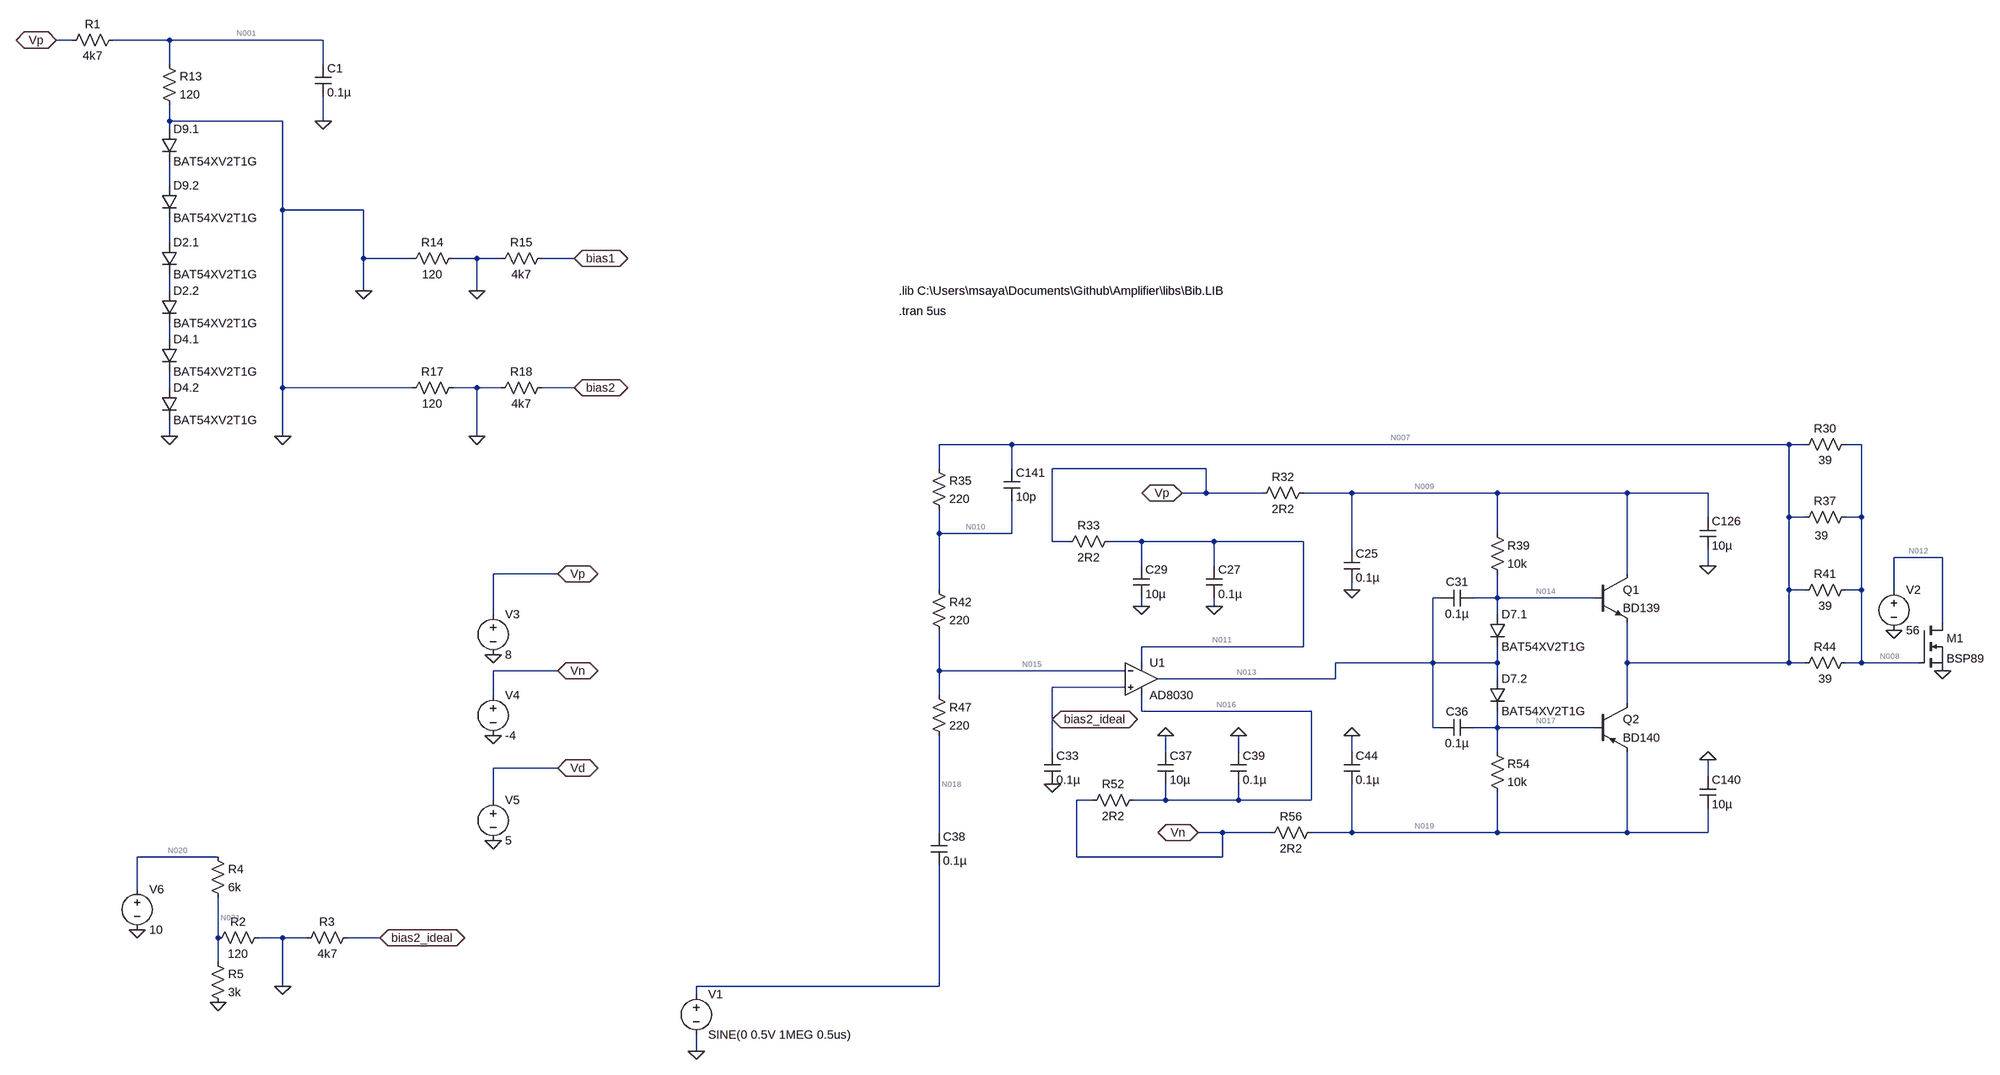
[diagram p0: schematic inv.asc]
inv.asc, the LTspice schematic file:
Version 4
SHEET 1 4920 3700
WIRE -480 1680 -512 1680
WIRE -288 1680 -400 1680
WIRE 16 1680 -288 1680
WIRE -288 1728 -288 1680
WIRE 16 1728 16 1680
WIRE -288 1840 -288 1808
WIRE -64 1840 -288 1840
WIRE 16 1840 16 1792
WIRE -288 1856 -288 1840
WIRE -288 1968 -288 1920
WIRE -64 2016 -64 1840
WIRE 96 2016 -64 2016
WIRE -288 2080 -288 2032
WIRE 96 2112 96 2016
WIRE 192 2112 96 2112
WIRE 320 2112 272 2112
WIRE 368 2112 320 2112
WIRE 512 2112 448 2112
WIRE -288 2176 -288 2144
WIRE 96 2176 96 2112
WIRE 320 2176 320 2112
WIRE -288 2272 -288 2240
WIRE -288 2368 -288 2336
WIRE -64 2368 -64 2016
WIRE 192 2368 -64 2368
WIRE 320 2368 272 2368
WIRE 368 2368 320 2368
WIRE 512 2368 448 2368
WIRE -288 2464 -288 2432
WIRE -64 2464 -64 2368
WIRE 320 2464 320 2368
WIRE 1536 2480 1392 2480
WIRE 3072 2480 1536 2480
WIRE 3104 2480 3072 2480
WIRE 3216 2480 3184 2480
WIRE 1392 2528 1392 2480
WIRE 1536 2528 1536 2480
WIRE 1920 2528 1616 2528
WIRE 1920 2576 1920 2528
WIRE 1920 2576 1872 2576
WIRE 2032 2576 1920 2576
WIRE 2208 2576 2112 2576
WIRE 2496 2576 2208 2576
WIRE 2752 2576 2496 2576
WIRE 2912 2576 2752 2576
WIRE 2912 2624 2912 2576
WIRE 3072 2624 3072 2480
WIRE 3104 2624 3072 2624
WIRE 3216 2624 3216 2480
WIRE 3216 2624 3184 2624
WIRE 1392 2656 1392 2608
WIRE 1536 2656 1536 2592
WIRE 1536 2656 1392 2656
WIRE 2496 2656 2496 2576
WIRE 1616 2672 1616 2528
WIRE 1648 2672 1616 2672
WIRE 1792 2672 1728 2672
WIRE 1936 2672 1792 2672
WIRE 2112 2672 1936 2672
WIRE 2208 2688 2208 2576
WIRE 3376 2704 3280 2704
WIRE 1792 2720 1792 2672
WIRE 1936 2720 1936 2672
WIRE 2912 2720 2912 2688
WIRE 480 2736 352 2736
WIRE 2752 2736 2752 2576
WIRE 1392 2768 1392 2656
WIRE 2208 2768 2208 2752
WIRE 3072 2768 3072 2624
WIRE 3104 2768 3072 2768
WIRE 3216 2768 3216 2624
WIRE 3216 2768 3184 2768
WIRE 3280 2768 3280 2704
WIRE 2384 2784 2368 2784
WIRE 2496 2784 2496 2736
WIRE 2496 2784 2448 2784
WIRE 2688 2784 2496 2784
WIRE 1792 2800 1792 2784
WIRE 1936 2800 1936 2784
WIRE 352 2816 352 2736
WIRE 2496 2816 2496 2784
WIRE 3376 2832 3376 2704
WIRE 2112 2880 2112 2672
WIRE 2112 2880 1792 2880
WIRE 1792 2912 1792 2880
WIRE 2368 2912 2368 2784
WIRE 2368 2912 2176 2912
WIRE 2496 2912 2496 2880
WIRE 2496 2912 2368 2912
WIRE 2752 2912 2752 2832
WIRE 3072 2912 3072 2768
WIRE 3072 2912 2752 2912
WIRE 3104 2912 3072 2912
WIRE 3216 2912 3216 2768
WIRE 3216 2912 3184 2912
WIRE 3328 2912 3216 2912
WIRE 480 2928 352 2928
WIRE 1392 2928 1392 2848
WIRE 1760 2928 1392 2928
WIRE 2176 2944 2176 2912
WIRE 2176 2944 1824 2944
WIRE 2496 2944 2496 2912
WIRE 1760 2960 1616 2960
WIRE 352 2976 352 2928
WIRE 1392 2976 1392 2928
WIRE 2752 2992 2752 2912
WIRE 1792 3008 1792 2976
WIRE 2128 3008 1792 3008
WIRE 1616 3024 1616 2960
WIRE 2368 3040 2368 2912
WIRE 2384 3040 2368 3040
WIRE 2496 3040 2496 3008
WIRE 2496 3040 2448 3040
WIRE 2688 3040 2496 3040
WIRE 1616 3088 1616 3024
WIRE 1840 3088 1840 3056
WIRE 1984 3088 1984 3056
WIRE 2208 3088 2208 3056
WIRE 2496 3088 2496 3040
WIRE 480 3120 352 3120
WIRE 2912 3136 2912 3104
WIRE 352 3184 352 3120
WIRE 1696 3184 1664 3184
WIRE 1840 3184 1840 3152
WIRE 1840 3184 1776 3184
WIRE 1984 3184 1984 3152
WIRE 1984 3184 1840 3184
WIRE 2128 3184 2128 3008
WIRE 2128 3184 1984 3184
WIRE 1392 3248 1392 3056
WIRE 1952 3248 1904 3248
WIRE 2048 3248 1952 3248
WIRE 2208 3248 2208 3152
WIRE 2208 3248 2128 3248
WIRE 2496 3248 2496 3168
WIRE 2496 3248 2208 3248
WIRE 2752 3248 2752 3088
WIRE 2752 3248 2496 3248
WIRE 2912 3248 2912 3200
WIRE 2912 3248 2752 3248
WIRE -192 3296 -352 3296
WIRE 1664 3296 1664 3184
WIRE 1952 3296 1952 3248
WIRE 1952 3296 1664 3296
WIRE -352 3360 -352 3296
WIRE -192 3456 -192 3376
WIRE -64 3456 -112 3456
WIRE -16 3456 -64 3456
WIRE 128 3456 64 3456
WIRE -192 3504 -192 3456
WIRE -64 3552 -64 3456
WIRE 1392 3552 1392 3312
WIRE 1392 3552 912 3552
WIRE 912 3568 912 3552
WIRE 912 3680 912 3648
FLAG 480 2736 Vp
IOPIN 480 2736 BiDir
FLAG 480 2928 Vn
IOPIN 480 2928 BiDir
FLAG 480 3120 Vd
IOPIN 480 3120 BiDir
FLAG 352 2896 0
FLAG 352 3056 0
FLAG 352 3264 0
FLAG 912 3680 0
FLAG 2208 3056 0
FLAG 2208 2768 0
FLAG 2912 2720 0
FLAG 2912 3104 0
FLAG 1872 2576 Vp
IOPIN 1872 2576 BiDir
FLAG 1904 3248 Vn
IOPIN 1904 3248 BiDir
FLAG 1984 3056 0
FLAG 1840 3056 0
FLAG 1936 2800 0
FLAG 1792 2800 0
FLAG -512 1680 Vp
IOPIN -512 1680 BiDir
FLAG 16 1840 0
FLAG 320 2176 0
FLAG -64 2464 0
FLAG -288 2464 0
FLAG 320 2464 0
FLAG 96 2176 0
FLAG 512 2112 bias1
IOPIN 512 2112 BiDir
FLAG 512 2368 bias2
IOPIN 512 2368 BiDir
FLAG 1616 3152 0
FLAG 3376 2928 0
FLAG 3280 2848 0
FLAG -64 3552 0
FLAG 128 3456 bias2_ideal
IOPIN 128 3456 BiDir
FLAG -192 3584 0
FLAG -352 3440 0
FLAG 1616 3024 bias2_ideal
IOPIN 1616 3024 BiDir
SYMBOL voltage 352 2800 R0
WINDOW 123 0 0 Left 0
WINDOW 39 0 0 Left 0
SYMATTR InstName V3
SYMATTR Value 8
SYMBOL voltage 352 2960 R0
WINDOW 123 0 0 Left 0
WINDOW 39 0 0 Left 0
SYMATTR InstName V4
SYMATTR Value -4
SYMBOL voltage 352 3168 R0
WINDOW 123 0 0 Left 0
WINDOW 39 0 0 Left 0
SYMATTR InstName V5
SYMATTR Value 5
SYMBOL res 1376 2512 R0
SYMATTR InstName R35
SYMATTR Value 220
SYMBOL res 1376 2752 R0
SYMATTR InstName R42
SYMATTR Value 220
SYMBOL res 1376 2960 R0
SYMATTR InstName R47
SYMATTR Value 220
SYMBOL cap 2192 2688 R0
SYMATTR InstName C25
SYMATTR Value 0.1µ
SYMBOL cap 2192 3088 R0
SYMATTR InstName C44
SYMATTR Value 0.1µ
SYMBOL cap 2448 2768 R90
WINDOW 0 0 32 VBottom 2
WINDOW 3 32 32 VTop 2
SYMATTR InstName C31
SYMATTR Value 0.1µ
SYMBOL cap 2448 3024 R90
WINDOW 0 0 32 VBottom 2
WINDOW 3 32 32 VTop 2
SYMATTR InstName C36
SYMATTR Value 0.1µ
SYMBOL cap 2896 2624 R0
SYMATTR InstName C126
SYMATTR Value 10µ
SYMBOL cap 2896 3136 R0
SYMATTR InstName C140
SYMATTR Value 10µ
SYMBOL res 2480 2640 R0
SYMATTR InstName R39
SYMATTR Value 10k
SYMBOL res 2480 3072 R0
SYMATTR InstName R54
SYMATTR Value 10k
SYMBOL diode 2480 2816 R0
SYMATTR InstName D7.1
SYMATTR Value BAT54XV2T1G
SYMBOL diode 2480 2944 R0
SYMATTR InstName D7.2
SYMATTR Value BAT54XV2T1G
SYMBOL npn 2688 2736 R0
SYMATTR InstName Q1
SYMATTR Value BD139
SYMBOL pnp 2688 2992 R0
SYMATTR InstName Q2
SYMATTR Value BD140
SYMBOL res 3200 2464 R90
WINDOW 0 0 56 VBottom 2
WINDOW 3 32 56 VTop 2
SYMATTR InstName R30
SYMATTR Value 39
SYMBOL res 3200 2608 R90
WINDOW 0 0 56 VBottom 2
WINDOW 3 37 63 VTop 2
SYMATTR InstName R37
SYMATTR Value 39
SYMBOL res 3200 2752 R90
WINDOW 0 0 56 VBottom 2
WINDOW 3 32 56 VTop 2
SYMATTR InstName R41
SYMATTR Value 39
SYMBOL res 3200 2896 R90
WINDOW 0 0 56 VBottom 2
WINDOW 3 32 56 VTop 2
SYMATTR InstName R44
SYMATTR Value 39
SYMBOL cap 1376 3248 R0
SYMATTR InstName C38
SYMATTR Value 0.1µ
SYMBOL res 2128 2560 R90
WINDOW 0 0 56 VBottom 2
WINDOW 3 32 56 VTop 2
SYMATTR InstName R32
SYMATTR Value 2R2
SYMBOL res 2144 3232 R90
WINDOW 0 0 56 VBottom 2
WINDOW 3 32 56 VTop 2
SYMATTR InstName R56
SYMATTR Value 2R2
SYMBOL cap 1520 2528 R0
SYMATTR InstName C141
SYMATTR Value 10p
SYMBOL cap 1824 3088 R0
SYMATTR InstName C37
SYMATTR Value 10µ
SYMBOL cap 1968 3088 R0
SYMATTR InstName C39
SYMATTR Value 0.1µ
SYMBOL res 1792 3168 R90
WINDOW 0 0 56 VBottom 2
WINDOW 3 32 56 VTop 2
SYMATTR InstName R52
SYMATTR Value 2R2
SYMBOL cap 1776 2720 R0
SYMATTR InstName C29
SYMATTR Value 10µ
SYMBOL cap 1920 2720 R0
SYMATTR InstName C27
SYMATTR Value 0.1µ
SYMBOL res 1744 2656 R90
WINDOW 0 0 56 VBottom 2
WINDOW 3 32 56 VTop 2
SYMATTR InstName R33
SYMATTR Value 2R2
SYMBOL voltage 912 3552 R0
WINDOW 123 0 0 Left 0
WINDOW 39 0 0 Left 0
SYMATTR InstName V1
SYMATTR Value SINE(0 0.5V 1MEG 0.5us)
SYMBOL res -384 1664 R90
WINDOW 0 0 56 VBottom 2
WINDOW 3 32 56 VTop 2
SYMATTR InstName R1
SYMATTR Value 4k7
SYMBOL res 288 2096 R90
WINDOW 0 0 56 VBottom 2
WINDOW 3 32 56 VTop 2
SYMATTR InstName R14
SYMATTR Value 120
SYMBOL res 464 2096 R90
WINDOW 0 0 56 VBottom 2
WINDOW 3 32 56 VTop 2
SYMATTR InstName R15
SYMATTR Value 4k7
SYMBOL res 288 2352 R90
WINDOW 0 0 56 VBottom 2
WINDOW 3 32 56 VTop 2
SYMATTR InstName R17
SYMATTR Value 120
SYMBOL res 464 2352 R90
WINDOW 0 0 56 VBottom 2
WINDOW 3 32 56 VTop 2
SYMATTR InstName R18
SYMATTR Value 4k7
SYMBOL res -304 1712 R0
SYMATTR InstName R13
SYMATTR Value 120
SYMBOL cap 0 1728 R0
SYMATTR InstName C1
SYMATTR Value 0.1µ
SYMBOL diode -304 1856 R0
SYMATTR InstName D9.1
SYMATTR Value BAT54XV2T1G
SYMBOL diode -304 1968 R0
SYMATTR InstName D9.2
SYMATTR Value BAT54XV2T1G
SYMBOL diode -304 2080 R0
SYMATTR InstName D2.1
SYMATTR Value BAT54XV2T1G
SYMBOL diode -304 2176 R0
SYMATTR InstName D2.2
SYMATTR Value BAT54XV2T1G
SYMBOL diode -304 2272 R0
SYMATTR InstName D4.1
SYMATTR Value BAT54XV2T1G
SYMBOL diode -304 2368 R0
SYMATTR InstName D4.2
SYMATTR Value BAT54XV2T1G
SYMBOL OpAmps\\AD8030 1792 2880 R0
SYMATTR InstName U1
SYMBOL cap 1600 3088 R0
SYMATTR InstName C33
SYMATTR Value 0.1µ
SYMBOL nmos 3328 2832 R0
SYMATTR InstName M1
SYMATTR Value BSP89
SYMBOL voltage 3280 2752 R0
WINDOW 123 0 0 Left 0
WINDOW 39 0 0 Left 0
SYMATTR InstName V2
SYMATTR Value 56
SYMBOL res -96 3440 R90
WINDOW 0 0 56 VBottom 2
WINDOW 3 32 56 VTop 2
SYMATTR InstName R2
SYMATTR Value 120
SYMBOL res 80 3440 R90
WINDOW 0 0 56 VBottom 2
WINDOW 3 32 56 VTop 2
SYMATTR InstName R3
SYMATTR Value 4k7
SYMBOL res -208 3280 R0
SYMATTR InstName R4
SYMATTR Value 6k
SYMBOL res -208 3488 R0
SYMATTR InstName R5
SYMATTR Value 3k
SYMBOL voltage -352 3344 R0
WINDOW 123 0 0 Left 0
WINDOW 39 0 0 Left 0
SYMATTR InstName V6
SYMATTR Value 10
TEXT 1312 2216 Left 2 !.tran 5us
TEXT 1312 2176 Left 2 !.lib C:\\Users\\msaya\\Documents\\Github\\Amplifier\\libs\\Bib.LIB

The netlist it stands for:
* inv.asc
V3 Vp 0 8
V4 Vn 0 -4
V5 Vd 0 5
R35 N007 N010 220
R42 N010 N015 220
R47 N015 N018 220
C25 N009 0 0.1µ
C44 0 N019 0.1µ
C31 N014 N013 0.1µ
C36 N017 N013 0.1µ
C126 N009 0 10µ
C140 0 N019 10µ
R39 N009 N014 10k
R54 N017 N019 10k
D7.1 N014 N013 BAT54XV2T1G
D7.2 N013 N017 BAT54XV2T1G
Q1 N009 N014 N007 0 BD139
Q2 N007 N017 N019 0 BD140
R30 N008 N007 39
R37 N008 N007 39
R41 N008 N007 39
R44 N008 N007 39
C38 N018 N022 0.1µ
R32 N009 Vp 2R2
R56 N019 Vn 2R2
C141 N007 N010 10p
C37 0 N016 10µ
C39 0 N016 0.1µ
R52 N016 Vn 2R2
C29 N011 0 10µ
C27 N011 0 0.1µ
R33 N011 Vp 2R2
V1 N022 0 SINE(0 0.5V 1MEG 0.5us)
R1 N001 Vp 4k7
R14 0 0 120
R15 bias1 0 4k7
R17 0 0 120
R18 bias2 0 4k7
R13 N001 0 120
C1 N001 0 0.1µ
D9.1 0 N002 BAT54XV2T1G
D9.2 N002 N003 BAT54XV2T1G
D2.1 N003 N004 BAT54XV2T1G
D2.2 N004 N005 BAT54XV2T1G
D4.1 N005 N006 BAT54XV2T1G
D4.2 N006 0 BAT54XV2T1G
XU1 bias2_ideal N015 N011 N016 N013 AD8040  ; AD8030, pins In+ In- V+ V- OUT
C33 bias2_ideal 0 0.1µ
M1 N012 N008 0 0 BSP89
V2 N012 0 56
R2 0 N021 120
R3 bias2_ideal 0 4k7
R4 N020 N021 6k
R5 N021 0 3k
V6 N020 0 10
.model D D
.lib standard.dio
.model NPN NPN
.model PNP PNP
.lib standard.bjt
.model NMOS NMOS
.model PMOS PMOS
.lib standard.mos
.tran 5us
.lib C:\Users\msaya\Documents\Github\Amplifier\libs\Bib.LIB
.lib ADI.lib
.backanno
.end

* Results of the author's LTspice run, read from the files saved beside the schematic
* Operating Point, zero values left out:
*   V(vp) = 8 V
*   V(vn) = -4 V
*   V(vd) = 5 V
*   V(n007) = 8.73 mV
*   V(n010) = 9.177 mV
*   V(n015) = 9.624 mV
*   V(n018) = 9.624 mV
*   V(n009) = 7.998 V
*   V(n019) = -3.999 V
*   V(n014) = 205.5 mV
*   V(n013) = -65.35 mV
*   V(n017) = -316.8 mV
*   V(n008) = 8.73 mV
*   V(n016) = -3.996 V
*   V(n011) = 7.997 V
*   V(n001) = 199.2 mV
*   V(bias2_ideal) = 9.55 mV
*   V(n012) = 56 V
*   V(n021) = 188.7 mV
*   V(n020) = 10 V
*   Ic(Q1) = 9.326 µA
*   Ib(Q1) = 967.4 nA
*   Ie(Q1) = -10.29 µA
*   Ic(Q2) = 12.33 µA
*   Ib(Q2) = -392.7 nA
*   Ie(Q2) = -11.93 µA
*   Id(M1) = 56.61 pA
*   Is(M1) = -56.61 pA
*   I(D7.1) = 778.3 µA
*   I(D7.2) = 367.8 µA
*   I(R35) = -2.032 µA
*   I(R42) = -2.032 µA
*   I(R39) = 779.3 µA
*   I(R54) = 368.2 µA
*   I(R32) = -788.6 µA
*   I(R56) = 380.2 µA
*   I(R52) = 1.742 mA
*   I(R33) = -1.336 mA
*   I(R1) = -1.66 mA
*   I(R13) = 1.66 mA
*   I(R2) = -1.572 mA
*   I(R3) = 2.032 µA
*   I(R4) = 1.635 mA
*   I(R5) = 62.89 µA
*   I(V3) = -3.784 mA
*   I(V4) = 2.122 mA
*   I(V2) = -112.6 pA
*   I(V6) = -1.635 mA
*   Ix(u1:1) = -2.032 µA
*   Ix(u1:2) = -2.032 µA
*   Ix(u1:3) = 1.336 mA
*   Ix(u1:4) = -1.742 mA
*   Ix(u1:5) = 410.5 µA
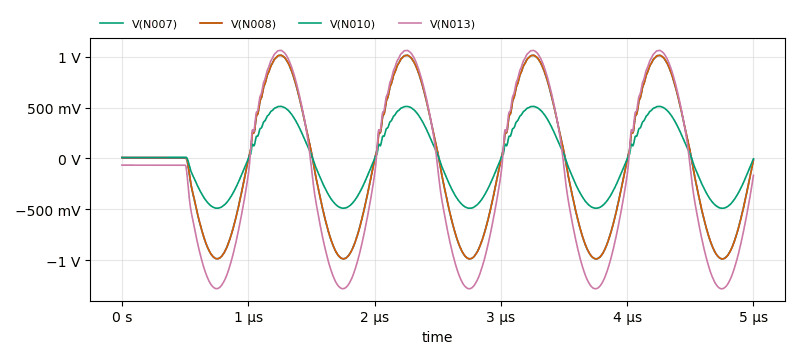
[diagram p1: Transient Analysis of inv.asc, plotted from the saved traces]
* Transient Analysis, 1 run:
*   V(N007): min -988 mV, max 1.016 V, average -48.96 mV, rms 670.6 mV, last -13.19 mV
*   V(N008): min -988 mV, max 1.016 V, average -48.96 mV, rms 670.6 mV, last -17.52 mV
*   V(N010): min -489.7 mV, max 513 mV, average -19.67 mV, rms 335.3 mV, last -3.168 mV
*   V(N013): min -1.282 V, max 1.064 V, average -177.2 mV, rms 824.7 mV, last -165.3 mV